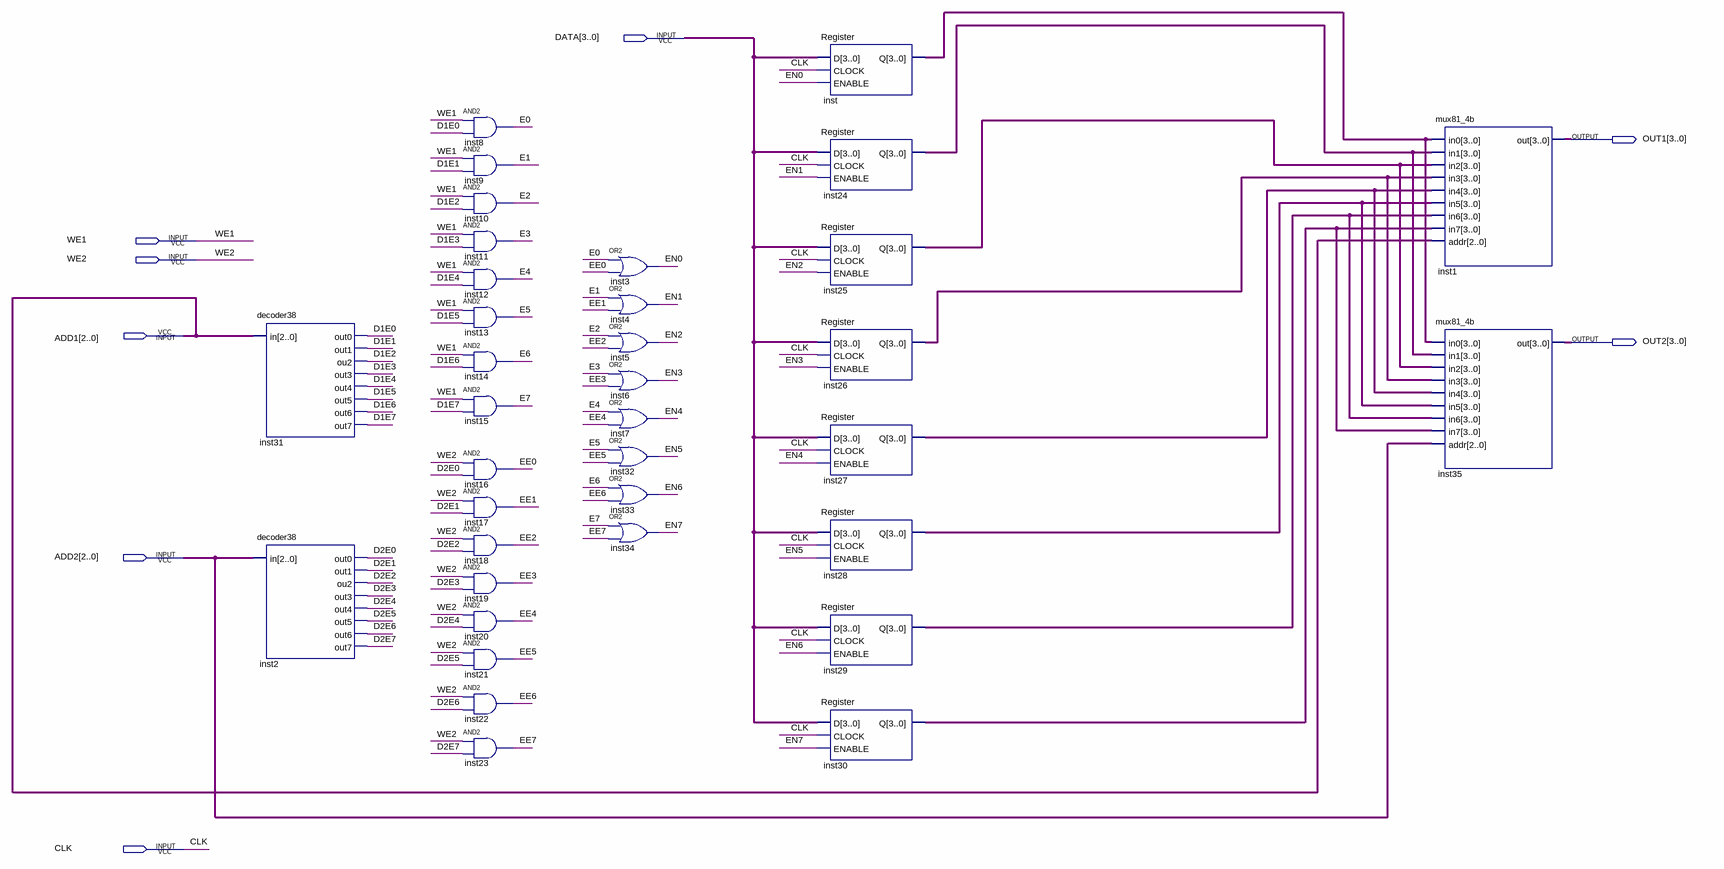
[diagram p0: schematic sheet]
// Quartus schematic Block3.bdf as structural Verilog: 36 symbols, 8 pins
module Block3 (
  input  [3:0] DATA,
  input  WE1,
  input  WE2,
  input  [2:0] ADD1,
  input  [2:0] ADD2,
  input  CLK,
  output [3:0] OUT1,
  output [3:0] OUT2
);

  wire D1E0, D1E1, D1E2, D1E3, D1E4, D1E5, D1E6, D1E7, D2E0, D2E1, D2E2, D2E3, D2E4, D2E5, D2E6, D2E7, E0,
       E1, E2, E3, E4, E5, E6, E7, EE0, EE1, EE2, EE3, EE4, EE5, EE6, EE7, EN0, EN1, EN2, EN3, EN4, EN5, EN6,
       EN7;
  wire [3:0] inst24_q, inst25_q, inst26_q, inst27_q, inst28_q, inst29_q, inst30_q, inst_q;

  decoder38 inst31 (
    .in(ADD1), .out0(D1E0), .out1(D1E1), .ou2(D1E2), .out3(D1E3), .out4(D1E4), .out5(D1E5), .out6(D1E6),
    .out7(D1E7));
  decoder38 inst2 (
    .in(ADD2), .out0(D2E0), .out1(D2E1), .ou2(D2E2), .out3(D2E3), .out4(D2E4), .out5(D2E5), .out6(D2E6),
    .out7(D2E7));
  and inst8 (E0, WE1, D1E0);
  and inst9 (E1, WE1, D1E1);
  and inst10 (E2, WE1, D1E2);
  and inst11 (E3, WE1, D1E3);
  and inst12 (E4, WE1, D1E4);
  and inst13 (E5, WE1, D1E5);
  and inst14 (E6, WE1, D1E6);
  and inst15 (E7, WE1, D1E7);
  and inst16 (EE0, WE2, D2E0);
  and inst17 (EE1, WE2, D2E1);
  and inst18 (EE2, WE2, D2E2);
  and inst19 (EE3, WE2, D2E3);
  and inst20 (EE4, WE2, D2E4);
  and inst21 (EE5, WE2, D2E5);
  and inst22 (EE6, WE2, D2E6);
  and inst23 (EE7, WE2, D2E7);
  or inst3 (EN0, E0, EE0);
  or inst4 (EN1, E1, EE1);
  or inst5 (EN2, E2, EE2);
  or inst6 (EN3, E3, EE3);
  or inst7 (EN4, E4, EE4);
  or inst32 (EN5, E5, EE5);
  or inst33 (EN6, E6, EE6);
  or inst34 (EN7, E7, EE7);
  Register inst (.D(DATA), .CLOCK(CLK), .ENABLE(EN0), .Q(inst_q));
  Register inst24 (.D(DATA), .CLOCK(CLK), .ENABLE(EN1), .Q(inst24_q));
  Register inst25 (.D(DATA), .CLOCK(CLK), .ENABLE(EN2), .Q(inst25_q));
  Register inst26 (.D(DATA), .CLOCK(CLK), .ENABLE(EN3), .Q(inst26_q));
  Register inst27 (.D(DATA), .CLOCK(CLK), .ENABLE(EN4), .Q(inst27_q));
  Register inst28 (.D(DATA), .CLOCK(CLK), .ENABLE(EN5), .Q(inst28_q));
  Register inst29 (.D(DATA), .CLOCK(CLK), .ENABLE(EN6), .Q(inst29_q));
  Register inst30 (.D(DATA), .CLOCK(CLK), .ENABLE(EN7), .Q(inst30_q));
  mux81_4b inst1 (
    .in0(inst_q), .in1(inst24_q), .in2(inst25_q), .in3(inst26_q), .in4(inst27_q), .in5(inst28_q),
    .in6(inst29_q), .in7(inst30_q), .addr(ADD1), .out(OUT1));
  mux81_4b inst35 (
    .in0(inst_q), .in1(inst24_q), .in2(inst25_q), .in3(inst26_q), .in4(inst27_q), .in5(inst28_q),
    .in6(inst29_q), .in7(inst30_q), .addr(ADD2), .out(OUT2));
endmodule
